# Altium project RGB_Ball.PrjPcb
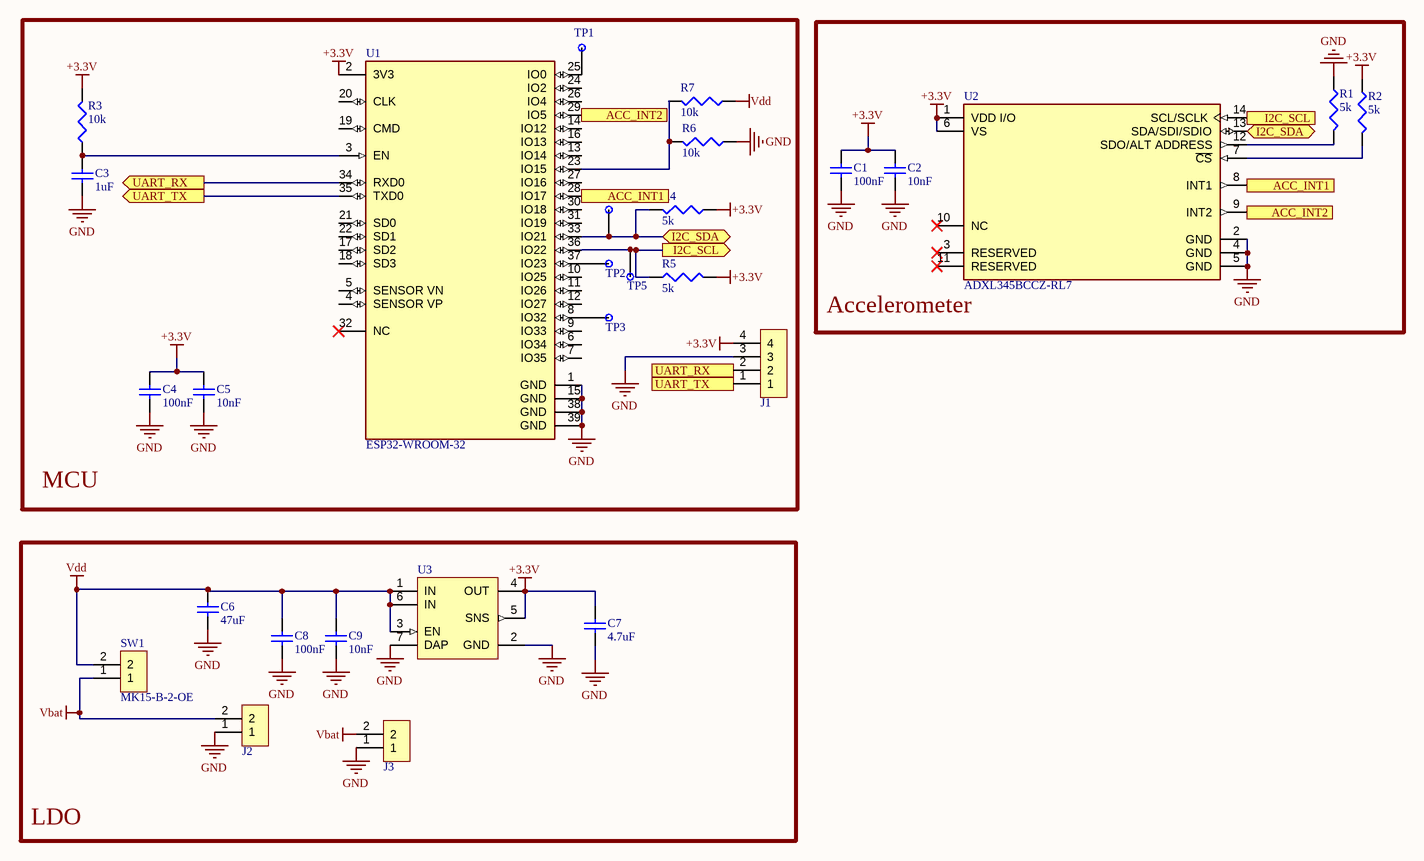
[diagram p0: Sheet1.SchDoc]
1 sheet, 28 parts. Net scope: flat (ports and power ports of the same name join across sheets).
Board file: PCB1.PcbDoc

## Sheet Sheet1.SchDoc
size 594 x 420 mm; SheetNumber: 1; SheetTotal: 1

### Parts
C1  100nF  [RESC1005X03N]
C2  10nF  [RESC1005X03N]
C3  1uF  [RESC1005X03N]
C4  100nF  [RESC1005X03N]
C5  10nF  [RESC1005X03N]
C6  47uF  [TAYO-C1210-2_L]
C7  4.7uF  [RESC1005X03N]
C8  100nF  [RESC1005X03N]
C9  10nF  [RESC1005X03N]
J1  H5P2.54  [4PAD]  (value not drawn)
J2  H2P2.54  [T2P2.54]  (value not drawn)
J3  H2P2.54  [T2P2.54]  (value not drawn)
R1  5k  [RESC1005X03N]
R2  5k  [RESC1005X03N]
R3  10k  [RESC1005X03N]
R4  5k  [RESC1005X03N]
R5  5k  [RESC1005X03N]
R6  10k  [RESC1005X03N]
R7  10k  [RESC1005X03N]
SW1  MK15-B-2-OE  [CAPMP16025X38N]
TP1  TESTPAD  [TESTPAD]  (value not drawn)
TP2  TESTPAD  [TESTPAD]  (value not drawn)
TP3  TESTPAD  [TESTPAD]  (value not drawn)
TP4  TESTPAD  [TESTPAD]  (value not drawn)
TP5  TESTPAD  [TESTPAD]  (value not drawn)
U1  ESP32-WROOM-32  [FP-ESP32-WROOM-32-MFG]
U2  ADXL345BCCZ-RL7  [FP-CC-14-1-MFG]
U3  ESP32-WROOM-32  [NGG0006A_V]  (value not drawn)

### Blocks framed on the sheet
MCU: C3-C5 J1 R3-R7 TP1-TP5 U1
Accelerometer: C1 C2 R1 R2 U2
LDO: C6-C9 J2 J3 SW1 U3

### Ports
ACC_INT1 (out), ACC_INT2 (out), I2C_SCL (in), I2C_SCL (out), I2C_SDA (bidir), UART_RX (in), UART_RX (out), UART_TX (in), UART_TX (out)

### Nets
+3.3V: C1.1 C2.1 C4.1 C5.1 C7.1 J1.4 R2.1 R3.2 R4.1 R5.2 U1.2(3V3) U2.1(VDD_I/O) U2.6(VS) U3.4(OUT) U3.5(SNS)
GND: C1.2 C2.2 C3.2 C4.2 C5.2 C6.1 C7.2 C8.2 C9.2 J1.3 J2.1 J3.1 R1.1 R6.1 U1.1(GND) U1.15(GND) U1.38(GND) U1.39(GND) U2.2(GND) U2.4(GND) U2.5(GND) U3.2(GND) U3.7(DAP)
Vbat: J2.2 J3.2 SW1.1
Vdd: C6.2 C8.1 C9.1 R7.1 SW1.2 U3.1(IN) U3.3(EN) U3.6(IN)
NetC3_1: C3.1 R3.1 U1.3(EN)
NetJ1_1: J1.1 U1.35(TXD0) ; port UART_TX
NetJ1_2: J1.2 U1.34(RXD0) ; port UART_RX
NetR1_2: R1.2 U2.12(SDO/ALT_ADDRESS)
NetR2_2: R2.2 U2.7(~{CS})
NetR4_2: R4.2 TP4.1 U1.33(IO21) U2.13(SDA/SDI/SDIO) ; port I2C_SDA
NetR5_1: R5.1 TP5.1 U1.36(IO22) U2.14(SCL/SCLK) ; port I2C_SCL
NetR6_2: R6.2 R7.2 U1.23(IO15)
NetTP1_1: TP1.1 U1.25(IO0)
NetTP2_1: TP2.1 U1.37(IO23)
NetTP3_1: TP3.1 U1.8(IO32)
NetU1_28: U1.28(IO17) U2.8(INT1) ; port ACC_INT1
NetU1_29: U1.29(IO5) U2.9(INT2) ; port ACC_INT2

Not connected (* = marked no-connect by the designer): U1 4(SENSOR_VP) 5(SENSOR_VN) 6(IO34) 7(IO35) 9(IO33) 10(IO25) 11(IO26) 12(IO27) 13(IO14) 14(IO12) 16(IO13) 17(SD2) 18(SD3) 19(CMD) 20(CLK) 21(SD0) 22(SD1) 24(IO2) 26(IO4) 27(IO16) 30(IO18) 31(IO19) 32(NC)*; U2 3(RESERVED)* 10(NC)* 11(RESERVED)*

### Notes on the sheet
- DWG NO:
- REV:
- THIS DOCUMENT AND THE DATA DISCLOSED HEREIN OR
- HEREWITH IS THE PROPERTY OF ALTIUM LIMITED AND MAY
- BE FREELY DISTRIBUTED IN WHOLE. NO RIGHTS ARE
- RESERVED OR EXPRESS OR IMPLIED WARANTEE GIVEN.
- REVISION
- DESCRIPTION
- DATE
- APPROVED
- ENG:
- APPROVALS
- PROJECT
- DSN:
- CHK:
- REFERENCE DOCUMENTS
- PROJECT REVISION:
- TITLE
- DOCUMENT REVISION:
- DESIGN ITEM:
- BOM:
- FAB DWG:
- PCB DWG:
- ASSY DWG:
- SCALE:
- A2
- SIZE
- CAGE CODE
- FILE NAME
- DWG NO.
- SHEET
- OF
- REV

### Library data of the parts
C1-C5 C7-C9 = CAP
C6 = CMP-2000-06559-1: High Value Multilayer Ceramic Capacitor, 47 uF, 10 V, +/- 20%, -55 to 125 degC, 2-Pin - LMK325B7476KM-PRSMD (C1210), RoHS, Tape and Reel; Manufacturer: Taiyo Yuden; Capacitance: 47µF; Voltage - Rated: 10V; Other Names: 587-2783-6; Online Catalog: MSeries; Temperature Coefficient: X7R; Applications: GeneralPurpose; Lead Spacing: -; Mounting Technology: SurfaceMount; Height - Seated (Max): -; Thickness (Max): 0.106"(2.70mm); Mounting Type: SurfaceMount,MLCC; Package / Case: 1210(3225Metric); Lead Style: -; Manufacturer URL: http://www.t-yuden.com/; Size / Dimension: 0.126"Lx0.098"W(3.20mmx2.50mm); Datasheet Version: 10/2014; Packaging: Digi-Reel®; Category: Capacitors; Datasheet URL: https://datasheet.ciiva.com/142/lmk325b7476mm-tr-ss-142765.pdf; Tolerance: ±20%; Features: -; Package Reference: C1210; Package Description: 2-Pin Surface Mount Device, Body 3.2 x 2.5 mm, Height 2.7 mm; Series: M; Family: CeramicCapacitors; Operating Temperature: -55°C~125°C; Standard Package: 1; Ratings: -
J1 = H4P2.54
R1-R7 = RES
U1 = CMP-194065-000008-1: RX TXRX MOD WIFI SURFACE MOUNT; Frequency: 2.5GHz; Sensitivity: -98dBm; Operating Supply Voltage: 3.6V; Data Rate: 150Mbps; Weight: 0.088185oz; Package Quantity: 550; Min Operating Temperature: -40°C; Mount: Surface Mount; Max Operating Temperature: 85°C; Packaging: Cut Tape; Case/Package: SMD/SMT
U2 = CMP-0885-00033-2: ACCEL 2-16G I2C/SPI 14LGA; Bandwidth: 0.05Hz; Nominal Supply Current: 140uA; Operating Supply Current: 145uA; -3db Bandwidth: 1.6kHz; Axis: X, Y, Z; Sensitivity: 256LSB/g; Output Type: Digital; Min Supply Voltage: 2V; Max Supply Voltage: 3.6V; Radiation Hardening: No; Number of Pins: 14; Length: 5mm; Package Quantity: 1; Max Operating Temperature: 85°C; Packaging: Tape and Reel; Min Operating Temperature: -40°C; Case/Package: LGA; Depth: 3mm; Lead Free: Contains Lead
U3 = CMP-0062-01530-4: 500mA Low Dropout CMOS Linear Regulators Stable with Ceramic Output Capacitors, 6-pin LLP, Pb-Free, 1000 Reel; PartNumber: LP38693SD-3.3/NOPB; Manufacturer: Texas Instruments; High-Reliability: Y; CompType: LDO IC; PackageTopMarking: ZXYTT*L130B; PackageReference: NGG0006A; PinCount: 6; RoHS: Y; ComponentLink1URL: http://www.ti.com/general/docs/lit/getliterature.tsp?genericPartNumber=LP38693&fileType=pdf; PowerWise: Y; PackageDescription: LLP, Plastic, Dual, 3 x 3 x 0.8mm Body, 6 Lead, 0.95mm Pitch, No Pullback; ComponentLink1Description: Datasheet URL